# Altium project cytron test 1.PrjPcb
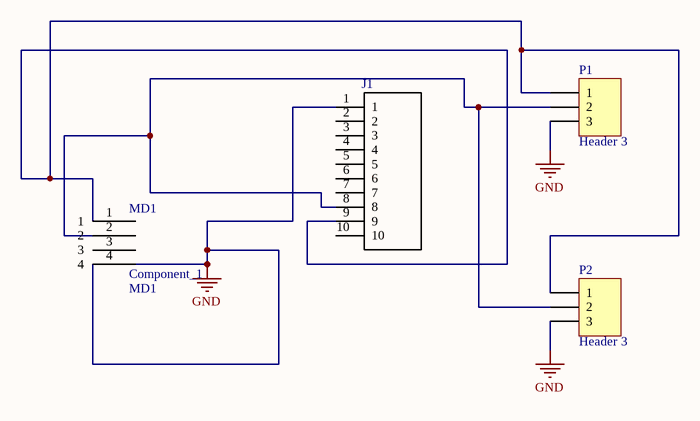
[diagram p0: Sheet3.SchDoc]
1 sheet, 4 parts. Net scope: global (net labels, ports and power ports of the same name join across sheets).

## Sheet Sheet3.SchDoc
size A4

### Parts
J1  5499913-1  [*TE_5499913-1]  (value not drawn)
MD1  Component_1  part num: MD1  [PCBComponent_1]
P1  Header 3  [HDR1X3]
P2  Header 3  [HDR1X3]

### Nets
GND: J1.1 MD1.4 P1.3 P2.3
NetJ1_8: J1.8 MD1.2 P1.2 P2.2
NetJ1_9: J1.9 MD1.1 P1.1 P2.1

Not connected (* = marked no-connect by the designer): J1 2 3 4 5 6 7 10; MD1 3

### Library data of the parts
J1 = 5499913-1: HEADER; UNIVERSAL EJECTION PIN; AMP-LATCH; 10 POS; 2.54 X 2.54; PCB; RIGHT ANGLE; Centerline_Pitch: 2.54 mm[.1 in]; MF: TE Connectivity; Number_of_Positions: 10; Product_Type: Connector; Price: None; SnapEDA_Link: https://www.snapeda.com/parts/5499913-1/TE%20Connectivity%20AMP%20Connectors/view-part/52128/?ref=snap; EU_RoHS_Compliance: Compliant; MP: 5499913-1; TE_purchase_URL: https://www.te.com/usa-en/product-5499913-1.html?te_bu=Cor&te_type=disp&te_campaign=seda_glo_cor-seda-global-disp-prtnr-fy19-seda-model-bom-cta_sma-317_1&elqCampaignId=32493; Availability: Unavailable; Package: None; Value: *
P1 P2 = Header 3: Header, 3-Pin; LatestRevisionDate: 17-Jul-2002; LatestRevisionNote: Re-released for DXP Platform.; Publisher: Altium Limited